# EAGLE design board (EAGLE 6.5.0)
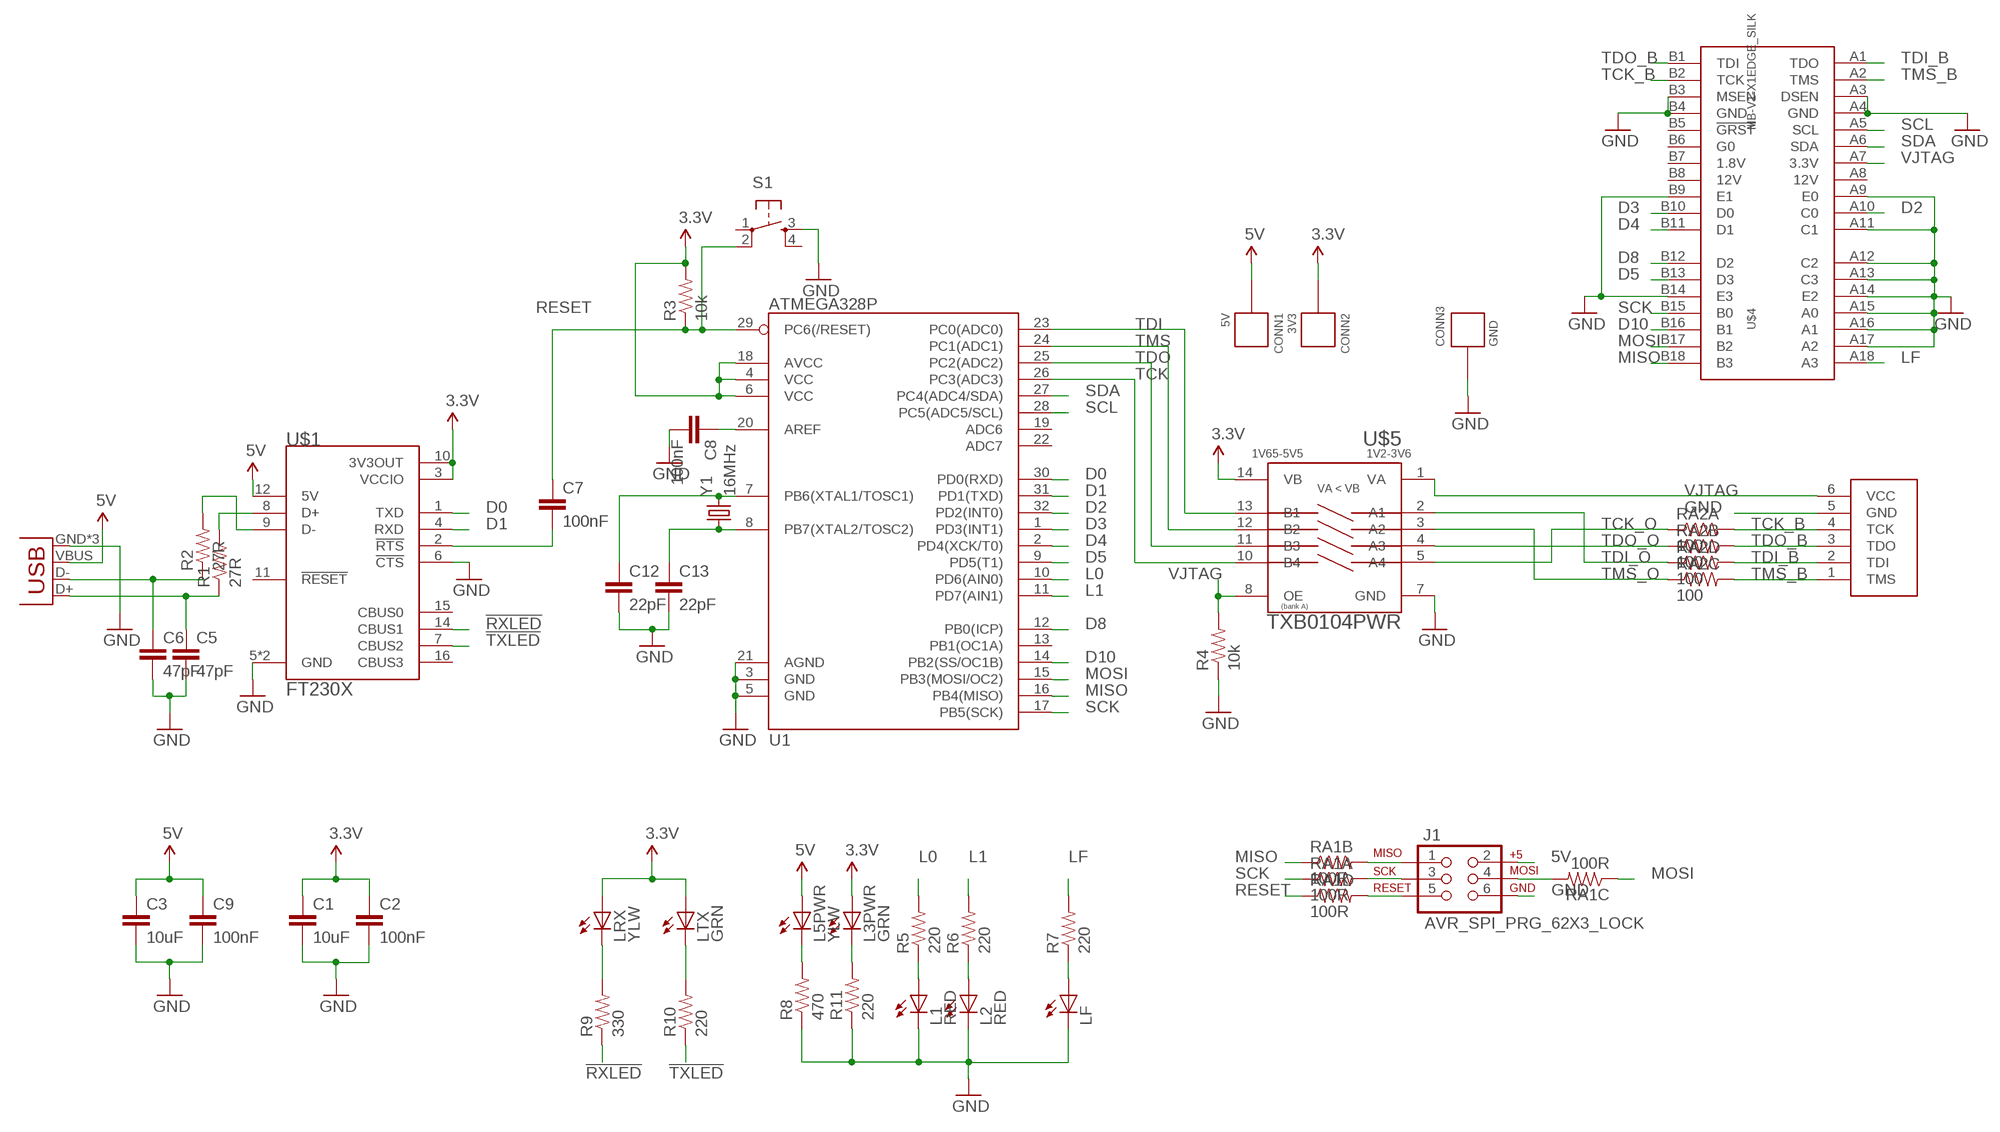
[diagram p0: schematic, sheet 1]

## Parts
C1  10uF  CAP0805  [0805]
C2  100nF  CAP0402-CAP  [0402-CAP]
C3  10uF  CAP0805  [0805]
C5  47pF  CAP0402-CAP  [0402-CAP]
C6  47pF  CAP0402-CAP  [0402-CAP]
C7  100nF  CAP0402-CAP  [0402-CAP]
C8  100nF  CAP0402-CAP  [0402-CAP]
C9  100nF  CAP0402-CAP  [0402-CAP]
C12  22pF  CAP0402-CAP  [0402-CAP]
C13  22pF  CAP0402-CAP  [0402-CAP]
CONN1  5V  CONNECTOR22AWG  [HOLE_22AWG]
CONN2  3V3  CONNECTOR22AWG  [HOLE_22AWG]
CONN3  GND  CONNECTOR22AWG  [HOLE_22AWG]
J1  AVR_SPI_PRG_62X3_LOCK  [2X3_LOCK]
JP1  USB-MICROB  [USB-MICROB]
L1  RED  LED0603  [0603_LED]
L2  RED  LED0603  [0603_LED]
L3PWR  GRN  LED0603  [0603_LED]
L5PWR  YLW  LED0603  [0603_LED]
LF  LED0603  [0603_LED]
LRX  YLW  LED0603  [0603_LED]
LTX  GRN  LED0603  [0603_LED]
R1  27R  RESISTOR0603  [0603-RES]
R2  27R  RESISTOR0603  [0603-RES]
R3  10k  RESISTOR0603  [0603-RES]
R4  10k  RESISTOR0603  [0603-RES]
R5  220  RESISTOR0603  [0603-RES]
R6  220  RESISTOR0603  [0603-RES]
R7  220  RESISTOR0603  [0603-RES]
R8  470  RESISTOR0603  [0603-RES]
R9  330  RESISTOR0603  [0603-RES]
R10  220  RESISTOR0603  [0603-RES]
R11  220  RESISTOR0603  [0603-RES]
RA1  100R  RESISTOR_ARRAY0603_X4  [0603-ARV]
RA2  100  RESISTOR_ARRAY0603_X4  [0603-ARV]
S1  TAC_SWITCHPTH  [TACTILE-PTH]
U1  ATMEGA328P  ATMEGA328_SMT  [TQFP32-08]
U$1  FT230X  [TSSOP16]
U$2  JTAGDIGILENT  [1X06]
U$4  MB-V1-X1EDGE_SILK  [MB-V1-X1-EDGE]
U$5  TXB0104PWR  [TSSOP14]
Y1  16MHz  CRYSTALHC49US  [HC49US]

## Nets
3.3V: C1.1 C2.1 CONN2.P L3PWR.A LRX.A LTX.A R3.2 U1.4(VCC) U1.6(VCC) U1.18(AVCC) U$1.3(VCCIO) U$1.10(3V3OUT) U$5.14(VB)
5V: C3.1 C9.1 CONN1.P J1.2 JP1.VBUS L5PWR.A U$1.12(5V)
!RXLED: R9.1 U$1.14(CBUS1)
!TXLED: R10.1 U$1.7(CBUS2)
D0: U1.30(PD0(RXD)) U$1.1(TXD)
D1: U1.31(PD1(TXD)) U$1.4(RXD)
D2: U1.32(PD2(INT0)) U$4.A10(C0)
D3: U1.1(PD3(INT1)) U$4.B10(D0)
D4: U1.2(PD4(XCK/T0)) U$4.B11(D1)
D5: U1.9(PD5(T1)) U$4.B13(D3)
D8: U1.12(PB0(ICP)) U$4.B12(D2)
D10: U1.14(PB2(SS/OC1B)) U$4.B16(B1)
GND: C1.2 C2.2 C3.2 C5.2 C6.2 C8.2 C9.2 C12.2 C13.2 CONN3.P J1.6 JP1.GND JP1.MT1(GND) JP1.MT2(GND) L1.C L2.C LF.C R4.1 R8.1 R11.1 S1.3 U1.3(GND) U1.5(GND) U1.21(AGND) U$1.5(GND) U$1.6(!CTS) U$1.13(GND) U$2.5(GND) U$4.A3(DSEN) U$4.A4(GND) U$4.A9(E0) U$4.A11(C1) U$4.A12(C2) U$4.A13(C3) U$4.A14(E2) U$4.A15(A0) U$4.A16(A1) U$4.A17(A2) U$4.B3(MSEN) U$4.B4(GND) U$4.B9(E1) U$4.B14(E3) U$5.7(GND)
L0: R5.2 U1.10(PD6(AIN0))
L1: R6.2 U1.11(PD7(AIN1))
LF: R7.2 U$4.A18(A3)
MISO: RA1.2 U1.16(PB4(MISO)) U$4.B18(B3)
MOSI: RA1.3 U1.15(PB3(MOSI/OC2)) U$4.B17(B2)
N$1: R1.2 U$1.8(D+)
N$2: R2.2 U$1.9(D-)
N$3: C6.1 JP1.D- R2.1
N$4: C5.1 JP1.D+ R1.1
N$5: C7.2 U$1.2(!RTS)
N$6: L1.A R5.1
N$7: C12.1 U1.7(PB6(XTAL1/TOSC1)) Y1.2
N$8: C8.1 U1.20(AREF)
N$9: J1.1 RA1.7
N$10: C13.1 U1.8(PB7(XTAL2/TOSC2)) Y1.1
N$11: L5PWR.C R8.2
N$12: L2.A R6.1
N$13: LF.A R7.1
N$15: LRX.C R9.2
N$16: LTX.C R10.2
N$17: J1.4 RA1.6
N$18: L3PWR.C R11.2
N$19: J1.5 RA1.5
N$20: J1.3 RA1.8
RESET: C7.1 R3.1 RA1.4 S1.2 U1.29(PC6(/RESET))
SCK: RA1.1 U1.17(PB5(SCK)) U$4.B15(B0)
SCL: U1.28(PC5(ADC5/SCL)) U$4.A5(SCL)
SDA: U1.27(PC4(ADC4/SDA)) U$4.A6(SDA)
TCK: U1.26(PC3(ADC3)) U$5.10(B4)
TCK_B: RA2.8 U$2.4(TCK) U$4.B2(TCK)
TCK_O: RA2.1 U$5.5(A4)
TDI: U1.23(PC0(ADC0)) U$5.13(B1)
TDI_B: RA2.5 U$2.2(TDI) U$4.A1(TDO)
TDI_O: RA2.4 U$5.2(A1)
TDO: U1.25(PC2(ADC2)) U$5.11(B3)
TDO_B: RA2.7 U$2.3(TDO) U$4.B1(TDI)
TDO_O: RA2.2 U$5.4(A3)
TMS: U1.24(PC1(ADC1)) U$5.12(B2)
TMS_B: RA2.6 U$2.1(TMS) U$4.A2(TMS)
TMS_O: RA2.3 U$5.3(A2)
VJTAG: R4.2 U$2.6(VCC) U$4.A7(3.3V) U$5.1(VA) U$5.8(OE)
Unconnected: S1.1 S1.4 U1.13(PB1(OC1A)) U1.19(ADC6) U1.22(ADC7) U$1.11(!RESET) U$1.15(CBUS0) U$1.16(CBUS3) U$4.A8(12V) U$4.B5(!GRST) U$4.B6(G0) U$4.B7(1.8V) U$4.B8(12V)

## Library data of the parts
C1-C3 C5-C9 C12 C13 = kmod-passives:CAP: Capacitor Standard 0603 ceramic capacitor, and 0.1" leaded capacitor.
CONN1-CONN3 = kmod-nonparts:CONNECTOR: Collection of holes/pads for testing/connecting
J1 = SparkFun-Connectors:AVR_SPI_PRG_6: AVR ISP 6 Pin This is the reduced ISP connector for AVR programming. Common on Arduino. This footprint will take up less PCB space and can be used with a 10-pin to 6-pin adapter such as SKU: BOB-08508
JP1 = SparkFun-Connectors:USB: USB Connectors USB-B-PTH is fully proven SKU : PRT-00139/CONN-08278 USB-miniB is fully proven SKU : PRT-00587 USB-A-PCB is untested. USB-A-H is throughly reviewed, but untested. Spark Fun Electronics SKU : PRT-00437 USB-B-SMT is throughly reviewed, but untested. Needs silkscreen touching up. USB-A-S has not been used/tested USB-MB-H has not been used/tested USB-MICROB has been used. CONN-09505; PROD_ID: CONN-09505
L1 L2 L3PWR L5PWR LF LRX LTX = kmod-passives:LED
R1-R11 = kmod-passives:RESISTOR: Resistor Basic schematic elements and footprints for 0603, 1206, and PTH resistors.
RA1 RA2 = kmod-passives:RESISTOR_ARRAY
S1 = kmod-mechanical:TAC_SWITCH: Momentary Switch Button commonly used for reset or general input. Spark Fun Electronics SKU : COM-00097 SMT- SWCH-08247
U1 = SparkFun-DigitalIC:ATMEGA328_SMT: 32-Pin Atmega328 part Commonly used on Arduino compatible boards Available in QFP and QFN packages TQFP is IC-09069 QFN is non-stock; PROD_ID: IC-09069
U$1 = kmod-testing:FT230X
U$2 = kmod-connectors:JTAG: JTAG connector, as on the Digilent Nexys3
U$4 = kmod-connectors:MB-V1-X1
U$5 = kmod-testing:TXB0104: TI 4-bit bidirectional voltage translator
Y1 = SparkFun-FreqCtrl:CRYSTAL: Various standard crystals. Proven footprints. Spark Fun Electronics SKU : COM-00534

## Board
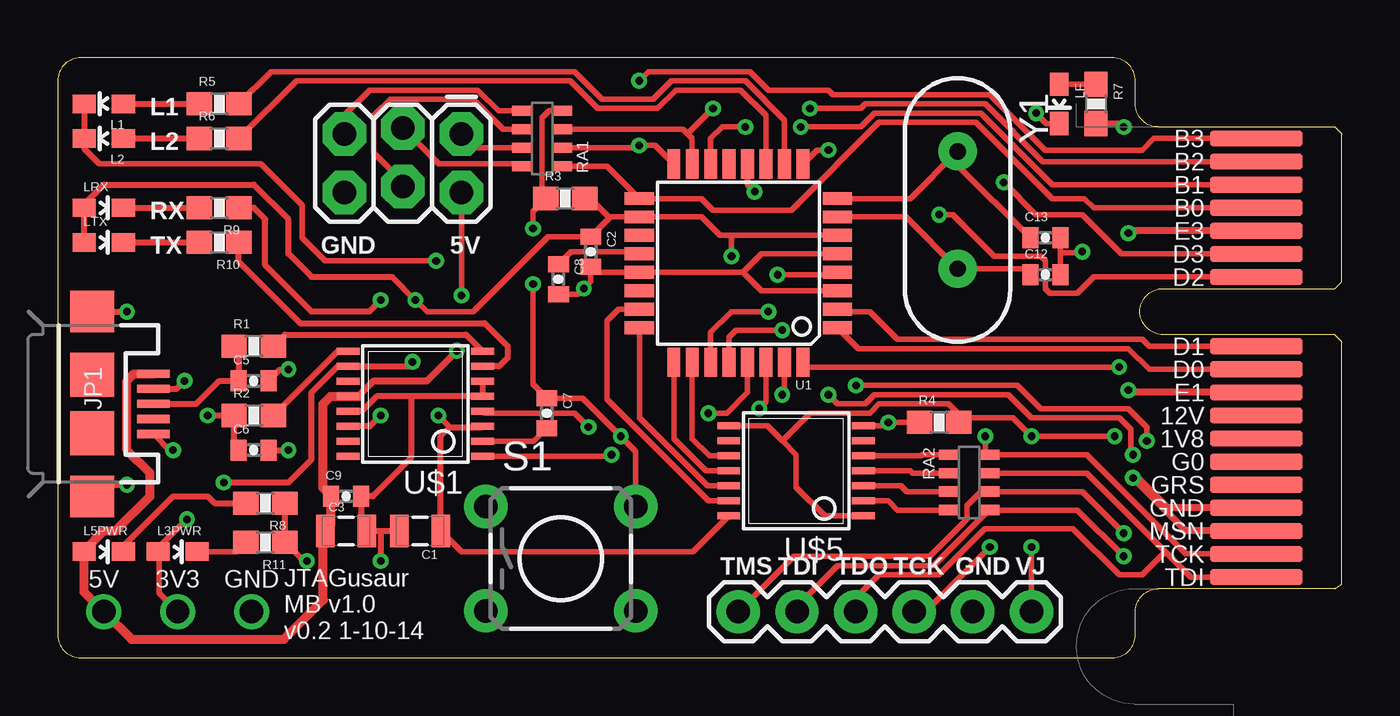
[diagram p1: board, top side]
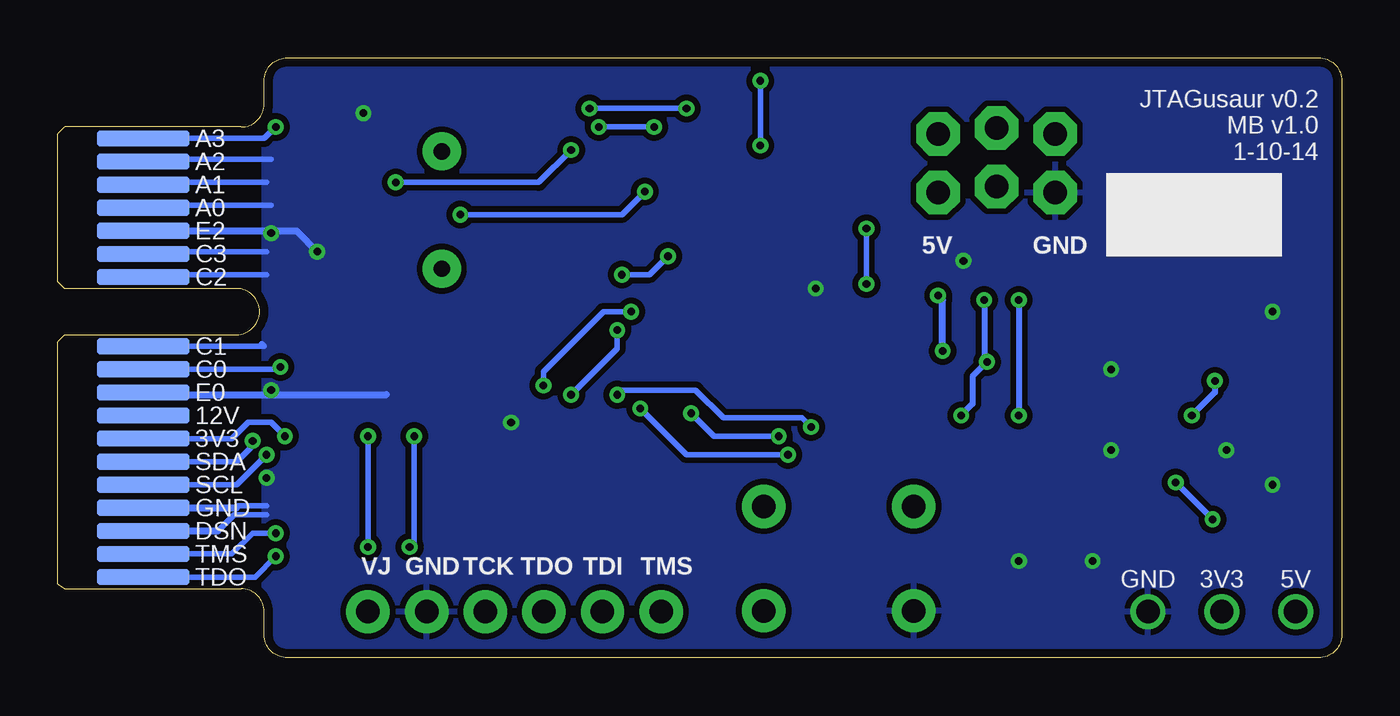
[diagram p2: board, bottom side, seen from below]

Size 55.65 x 26 mm. Coordinates in mm from the lower left corner, seen from the top.
Outline: 47.7,3 arc90 46.7,2 46.7,1 arc-90 45.7,0 1,0 arc-90 0,1 0,25 arc-90 1,26 45.7,26 arc-90 46.7,25 46.7,24 arc90 47.7,23
Copper layers (1*16): Top 0.0356mm / dielectric 1.5011mm / Bottom 0.0356mm
Design rules "OSHPark_mine *": minimum track width 6mil, minimum drill 13mil, track to track 6mil, track to pad 6mil, pad to pad 6mil, via to via 6mil, smd to smd 6mil, copper to edge 15mil, drill to drill 6mil, minimum pad ring 7mil, minimum via ring 7mil, stop-mask expansion 2mil, vias tented up to drill 13mil, thermal gap 10mil

### Footprints (pad centres in the part's own frame; a part is rotated, then mirrored left to right if it is on the bottom)
0805 = smd 0.8 x 1.4: 1 -0.9,0; 2 0.9,0
0402-CAP = smd 0.7 x 0.9: 1 -0.65,0; 2 0.65,0
HOLE_22AWG = drill 1.016: P 0,0
2X3_LOCK = drill 1.016 pad 1.88 octagon: 1 0,0; 2 0,2.54; 3 2.54,-0.254; 4 2.54,2.286; 5 5.08,0; 6 5.08,2.54
USB-MICROB = smd 0.35 x 1.4: D+ 0,2.65; D- -0.65,2.65; GND 1.3,2.65; ID 0.65,2.65; VBUS -1.3,2.65 | smd 1.8 x 1.9: MT1 -4,0; MT2 4,0 | smd 1.9 x 1.9: P$1 -1.27,0; P$2 1.27,0
0603_LED = smd 0.8 x 1.003: A 0,-0.852; C 0,0.852
0603-RES = smd 1.1 x 1: 1 -0.85,0; 2 0.85,0
0603-ARV = smd 0.45 x 0.9: 1 -1.2,-0.85; 2 -0.4,-0.85; 3 0.4,-0.85; 4 1.2,-0.85; 5 1.2,0.85; 6 0.4,0.85; 7 -0.4,0.85; 8 -1.2,0.85
TACTILE-PTH = drill 1.016 pad 1.88: 1 -3.251,2.261; 2 3.251,2.261; 3 -3.251,-2.261; 4 3.251,-2.261
TQFP32-08 = smd 1.27 x 0.559: 1 -4.293,2.8; 2 -4.293,2; 3 -4.293,1.2; 4 -4.293,0.4; 5 -4.293,-0.4; 6 -4.293,-1.2; 7 -4.293,-2; 8 -4.293,-2.8; 17 4.293,-2.8; 18 4.293,-2; 19 4.293,-1.2; 20 4.293,-0.4; 21 4.293,0.4; 22 4.293,1.2; 23 4.293,2; 24 4.293,2.8 | smd 0.559 x 1.27: 9 -2.8,-4.293; 10 -2,-4.293; 11 -1.2,-4.293; 12 -0.4,-4.293; 13 0.4,-4.293; 14 1.2,-4.293; 15 2,-4.293; 16 2.8,-4.293; 25 2.8,4.293; 26 2,4.293; 27 1.2,4.293; 28 0.4,4.293; 29 -0.4,4.293; 30 -1.2,4.293; 31 -2,4.293; 32 -2.8,4.293
TSSOP16 = smd 0.305 x 0.991: 1 -2.275,-2.918; 2 -1.625,-2.918; 3 -0.975,-2.918; 4 -0.325,-2.918; 5 0.325,-2.918; 6 0.975,-2.918; 7 1.625,-2.918; 8 2.275,-2.918; 9 2.275,2.918; 10 1.625,2.918; 11 0.975,2.918; 12 0.325,2.918; 13 -0.325,2.918; 14 -0.975,2.918; 15 -1.625,2.918; 16 -2.275,2.918
1X06 = drill 1.016 pad 1.88: 1 0,0; 2 2.54,0; 3 5.08,0; 4 7.62,0; 5 10.16,0; 6 12.7,0
MB-V1-X1-EDGE = smd 0.7 x 4 bottom: A1 -11.5,-0.75; A2 -10.5,-0.75; A3 -9.5,-0.75; A4 -8.5,-0.75; A5 -7.5,-0.75; A6 -6.5,-0.75; A7 -5.5,-0.75; A8 -4.5,-0.75; A9 -3.5,-0.75; A10 -2.5,-0.75; A11 -1.5,-0.75; A12 1.5,-0.75; A13 2.5,-0.75; A14 3.5,-0.75; A15 4.5,-0.75; A16 5.5,-0.75; A17 6.5,-0.75; A18 7.5,-0.75 | smd 0.7 x 4: B1 -11.5,-0.75; B2 -10.5,-0.75; B3 -9.5,-0.75; B4 -8.5,-0.75; B5 -7.5,-0.75; B6 -6.5,-0.75; B7 -5.5,-0.75; B8 -4.5,-0.75; B9 -3.5,-0.75; B10 -2.5,-0.75; B11 -1.5,-0.75; B12 1.5,-0.75; B13 2.5,-0.75; B14 3.5,-0.75; B15 4.5,-0.75; B16 5.5,-0.75; B17 6.5,-0.75; B18 7.5,-0.75
TSSOP14 = smd 0.305 x 0.991: 1 -1.95,-2.918; 2 -1.3,-2.918; 3 -0.65,-2.918; 4 0,-2.918; 5 0.65,-2.918; 6 1.3,-2.918; 7 1.95,-2.918; 8 1.95,2.918; 9 1.3,2.918; 10 0.65,2.918; 11 0,2.918; 12 -0.65,2.918; 13 -1.3,2.918; 14 -1.95,2.918
HC49US = drill 0.7 pad 1.651: 1 -2.54,0; 2 2.54,0

### Placement (x,y rotation side)
C1  15.7,5.5 180 top
C2  23.1,17.6 270 top
C3  12.5,5.5 0 top
C5  8.5,12 0 top
C6  8.5,9 0 top
C7  21.2,10.6 270 top
C8  21.7,16.4 270 top
C9  12.5,7 0 top
C12  42.8,16.6 0 top
C13  42.8,18.2 0 top
CONN1  2,2 180 top
CONN2  5.2,2 180 top
CONN3  8.4,2 180 top
J1  17.5,22.7 180 top
JP1  1.5,11 270 top
L1  2,24 90 top
L2  2,22.5 90 top
L3PWR  5.2,4.6 270 top
L5PWR  2,4.6 270 top
LF  43.4,24 180 top
LRX  2,19.5 270 top
LTX  2,18 270 top
R1  8.5,13.5 0 top
R2  8.5,10.5 0 top
R3  22,19.9 0 top
R4  38.2,10.2 0 top
R5  7,24 0 top
R6  7,22.5 0 top
R7  45,24 270 top
R8  9,6.7 180 top
R9  7,19.5 180 top
R10  7,18 180 top
R11  9,5 180 top
RA1  21,22.5 90 top
RA2  39.5,7.6 270 top
S1  21.8,4.3 0 top
U1  29.5,17.1 180 top
U$1  15.5,11 90 top
U$2  29.5,2 0 top
U$4  51.2,15 90 top
U$5  32,8.1 90 top
Y1  39,19.4 270 top

### Tracks (layer width: path | path; a pad name or v marks a point on that pad's centre or on a via)
3.3V  (via drill 0.33)
  Top 0.229: 23.93,19.07 C2.1 21.25,18.25 18,15 16,15 v15.5,15.5 | 23.93,19.07 23.95,19.1 U1.18 27.9,19.1 28.7,18.3 29.2,18.3 | 29.2,18.3 U1.6 | U1.4 33.69,16.6 v31.2,16.6 | v29.2,17.4 29.2,18.3 | R3.2 23.1,19.9 23.93,19.07 | U$5.14 27.53,4.6 17.5,4.6 C1.1 | CONN2.P 4.4,2.8 4.4,4.55 L3PWR.A 4.35,4.85 4.45,4.85 v5.6,6
  Top 0.254: LTX.A LRX.A 1.15,19.65 2,20.5 8.5,20.5 10,19 10,17.5 11,16.5 14.5,16.5 v15.5,15.5 | v7.2,7.6 10,7.6 11,8.6 11,11.5 12.12,12.62 U$1.10 15.18,12.62 v15.38,12.82 | C1.1 16.6,9.6 17,10 | 17,10 18.39,10 U$1.3 | v16.5,10.5 17,10
  Bottom 0.229: v31.2,16.6 30,16.6 v29.2,17.4
  Bottom 0.254: v5.6,6 v7.2,7.6 | v16.5,10.5 16,11 16,12.2 v15.38,12.82 15.5,12.95 v15.5,15.5
5V  (via drill 0.33)
  Top 0.229: v17.5,15.7 J1.2
  Top 0.254: L5PWR.A 1.15,4.65
  Top 0.305: 13.03,11.32 13.7,12 16,12 v17.3,13.3
  Top 0.381: L5PWR.A 1.15,2.85 CONN1.P 3.2,0.8 9.8,0.8 11.51,2.51 11.51,5.41 C3.1 11.85,5.75 C9.1 11.5,7.35 11.5,11 11.82,11.32 U$1.12 13.03,11.32 | 1.15,4.65 2,5.5 2.5,5.5 4,7 4,8 3,9 3,12 3.3,12.3 JP1.VBUS
  Bottom 0.305: v17.3,13.3 17.3,15.5 v17.5,15.7
!RXLED  (via drill 0.33)
  Top 0.254: R9.1 8.5,19.5 9,19 9,17 11,15 13.5,15 v14,15.5 | v14,10.5 13.53,10.03 U$1.14
  Bottom 0.254: v14,15.5 v14,10.5
!TXLED
  Top 0.254: U$1.7 19.12,12.62 19.5,13 19.5,13.5 18.5,14.5 10.5,14.5 7.85,17.15 R10.1
D0  (via drill 0.33)
  Top 0.229: U$1.1 23.93,8.72 v24,8.8 | v30.4,10.8 30.7,11.1 U1.30
  Bottom 0.229: v24,8.8 28.4,8.8 v30.4,10.8
D1  (via drill 0.33)
  Top 0.229: U$1.4 18.49,10.6 22.4,10.6 v23,10 | v31.4,11.4 31.5,11.5 U1.31
  Bottom 0.229: v23,10 23.4,10.4 26.8,10.4 28,11.6 31.2,11.6 v31.4,11.4
D2  (via drill 0.33)
  Top 0.229: v46,12.6 32.51,12.6 U1.32
  Bottom 0.229: U$4.A10 46.1,12.5 v46,12.6
D3
  Top 0.229: U$4.B10 47.3,12.5 46.4,13.4 34.69,13.4 U1.1
D4
  Top 0.229: U$4.B11 47.3,13.5 47,13.8 37.8,13.8 37.6,13.8 36.4,13.8 35.2,15 33.89,15 U1.2
D5  (via drill 0.33)
  Top 0.229: U1.9 32.91,22 v33.4,22 | v41,20.6 42.4,19.2 44.4,19.2 46.1,17.5 U$4.B13
  Bottom 0.229: v33.4,22 34.8,20.6 v41,20.6
D8  (via drill 0.33)
  Top 0.229: U1.12 29.9,20.5 v30.2,20.2 | v38.2,19.2 38.8,19.2 40.6,17.4 42.6,17.4 42.8,17.2 42.8,16 43,15.8 44.2,15.8 44.9,16.5 U$4.B12
  Bottom 0.229: v30.2,20.2 31.2,19.2 v38.2,19.2
D10  (via drill 0.33)
  Top 0.229: U$4.B16 43.1,20.5 40,23.6 35.4,23.6 34.8,23 v32.2,23 | v29.8,23 28.8,23 28.3,22.5 U1.14
  Bottom 0.229: v32.2,23 v29.8,23
GND  (via drill 0.33)
  Top 0.229: LF.C 42.85,23.15 v42.4,23.6 | U1.5 30.5,17.5 29.7,16.7 | 29.7,16.7 U1.21 23.35,16.7 C2.2 23.1,16.3 v22.8,16 22.55,15.75 C8.2 | U1.3 30.5,15.9 29.7,16.7 | C13.2 43.45,17.54 | 43.45,17.54 C12.2 | 43.45,17.54 44.34,17.54 v44.4,17.6 | U$5.7 35.85,10.05 v36,10.2 R4.1 | L2.C 1.15,22.05 1.8,21.4 8.8,21.4 10.6,19.6 10.6,18.2 11.6,17.2 v16.4,17.2 | R11.1 10.65,4.2 v10.8,4.2
  Top 0.254: JP1.MT2 2,7.5 v3,7.5 | JP1.GND 4.85,9 v5,9 | JP1.MT1 v3,15 | C5.2 9.65,12.5 v10,12.5 | C6.2 v10,9 | R11.1 R8.1 | U$1.6 U$1.5 15.31,11.32 | 15.31,11.32 13.82,11.32 13.18,10.68 U$1.13 | 15.31,11.32 15.31,8.66 13.65,7 C9.2 13.15,5.75 C3.2 14,5.5 | 14,5.5 C1.2 | 14,5.5 v14,4.2 | L1.C L2.C
  Top 0.305: U$4.A3 48.9,5.5 v46.6,7.8 46.8,7.8 48.1,6.5 U$4.A4 | U$4.B14 46.5,18.5 v46.4,18.4 | U$4.B9 46.5,11.5 v46.4,11.6
  Bottom 0.229: U$4.A12 51.85,16.6 46.6,16.6 | U$4.A13 51.85,17.6 46.6,17.6 | U$4.A15 51.85,19.6 46.4,19.6 | U$4.A16 51.85,20.6 46.6,20.6 | U$4.A17 51.85,21.6 46.4,21.6 | U$4.A11 46.7,13.5 46.8,13.6 | 48.7,5.5 48,6.2 46.6,6.2 | 47.9,6.5 47.8,6.6 46.6,6.6
  Bottom 0.305: U$4.A4 47.9,6.5 | U$4.A3 48.7,5.5 | U$4.B9 51.85,11.4 41.4,11.4 | U$4.B14 45.3,18.5 v44.4,17.6
  pour Bottom (isolate 0.254): 46.7,0 0,0 0,26 46.7,26
L0
  Top 0.229: R5.2 9.25,25.4 22.4,25.4 23.6,24.2 25.8,24.2 26.6,25 29.8,25 31.5,23.3 U1.10
L1
  Top 0.229: R6.2 10.35,25 22.2,25 23.4,23.8 26,23.8 26.8,24.6 29.6,24.6 30.7,23.5 U1.11
LF  (via drill 0.33)
  Top 0.229: v46.2,23 46.05,23.15 R7.2
  Bottom 0.229: U$4.A18 46.7,22.5 v46.2,23
MISO  (via drill 0.33)
  Top 0.229: U1.16 25.89,22.2 v25.2,22.2 25.1,22.1 RA1.2 | U$4.B18 47.5,22.5 47,22 42.8,22 40.4,24.4 33.6,24.4 33.4,24.6 30.8,24.6 30,25.4 25.6,25.4 v25.2,25
  Bottom 0.229: v25.2,25 v25.2,22.2
MOSI  (via drill 0.33)
  Top 0.229: RA1.3 27.1,22.9 27.3,22.7 | 27.3,22.7 27.5,22.5 U1.15 | U$4.B17 42.7,21.5 40.2,24 35,24 34.8,23.8 v32.6,23.8 | v28.4,23.8 27.3,22.7
  Bottom 0.229: v32.6,23.8 v28.4,23.8
N$1
  Top 0.254: R1.2 9.85,14 17.69,14 U$1.8
N$2
  Top 0.254: R2.2 12.12,13.28 U$1.9
N$3  (via drill 0.33)
  Top 0.254: C6.1 7.65,9.2 R2.1 v6.5,10.5 | JP1.D- 5.15,11.65 v5.5,12
  Bottom 0.254: v5.5,12 5.5,11.5 v6.5,10.5
N$4
  Top 0.254: R1.1 7.85,13.3 C5.1 7,12 6,11 JP1.D+
N$5
  Top 0.229: U$1.2 20.62,9.38 C7.2
N$6
  Top 0.254: L1.A R5.1
N$7
  Top 0.229: U1.7 36.76,19.1 Y1.2 41.89,16.86 C12.1
N$8
  Top 0.229: U1.20 25.11,17.6 22.25,17.6 C8.1
N$9
  Top 0.229: RA1.7 18.1,22.1 J1.1
N$10
  Top 0.229: U1.8 36.96,19.9 Y1.1 39,21.35 C13.1
N$11
  Top 0.254: L5PWR.C 2.85,4.85 5,7 6.5,7 6.8,6.7 R8.2
N$12
  Top 0.254: L2.A R6.1
N$13
  Top 0.229: LF.A R7.1
N$15
  Top 0.254: LRX.C R9.2
N$16
  Top 0.254: LTX.C R10.2
N$17
  Top 0.229: RA1.6 19.3,22.9 18,24.2 14.4,24.2 13.7,23.5 13.7,21.87 14.96,20.61 J1.4
N$18
  Top 0.229: L3PWR.C 7.75,4.6 R11.2
N$19
  Top 0.229: RA1.5 19.1,23.7 18.2,24.6 13.52,24.6 12.42,23.5 J1.5
N$20
  Top 0.229: RA1.8 20.05,21.4 16.51,21.4 J1.3
RESET  (via drill 0.33)
  Top 0.229: RA1.4 21.3,23.7 21,23.4 21,20.05 R3.1 20.6,19.35 v20.6,18.6 | S1.2 25.05,8.95 v24.4,9.6 22.75,11.25 C7.1 20.6,11.85 v20.6,16.2 | v28.2,10.6 29,10.6 29.9,11.5 U1.29
  Bottom 0.229: v20.6,16.2 v20.6,18.6 | v24.4,9.6 27.2,9.6 v28.2,10.6
SCK
  Top 0.229: RA1.1 23.81,21.3 U1.17 27.9,19.9 28.4,19.4 31.8,19.4 35.6,23.2 39.8,23.2 43.1,19.9 44.5,19.9 44.9,19.5 U$4.B15
SCL  (via drill 0.33)
  Top 0.229: U1.28 29.1,13.9 29.4,14.2 v31.4,14.2 | v33.4,11.4 33.8,11 35,11 35.4,11.4 41.2,11.4 42.2,10.4 46,10.4 46.5,9.9 46.5,8.9 v46.6,8.8
  Bottom 0.229: v31.4,14.2 31.4,13.4 v33.4,11.4 | v46.6,8.8 47.9,7.5 U$4.A5
SDA  (via drill 0.33)
  Top 0.229: U1.27 28.3,14.1 29.2,15 v30.8,15 | v34.6,11.8 41.6,11.8 42.6,10.8 46.4,10.8 47.2,10 v47.2,9.4
  Bottom 0.229: v30.8,15 32,15 34.6,12.4 v34.6,11.8 | v47.2,9.4 47.2,9.2 47.9,8.5 U$4.A6
TCK
  Top 0.229: U$5.10 28.25,8.75 27.5,9.5 U1.26
TCK_B  (via drill 0.33)
  Top 0.229: U$4.B2 48.9,4.5 44.6,8.8 RA2.8 40.2,8.95 v40.2,9.6 | v40.4,4.8 37.6,2 U$2.4
  Bottom 0.229: v40.4,4.8 40.2,5 v40.2,9.6
TCK_O
  Top 0.229: U$5.5 37.4,8.75 37.45,8.8 RA2.1
TDI
  Top 0.229: U$5.13 28.2,6.8 23.8,11.2 23.8,14.6 24.3,15.1 U1.23
TDI_B  (via drill 0.33)
  Top 0.229: v46.2,4.4 44.2,6.4 RA2.5 37.95,4 33.8,4 32.04,2.24 U$2.2
  Bottom 0.229: U$4.A1 47.1,3.5 v46.2,4.4
TDI_O
  Top 0.229: U$5.2 36,6.8 36.4,6.4 RA2.4
TDO
  Top 0.229: U$5.11 28.1,8.1 26.7,9.5 U1.25
TDO_B
  Top 0.229: U$4.B1 49.1,3.5 48,4.6 | 48,4.6 44.6,8 RA2.7 | 48,4.6 47,3.6 46,3.6 44,5.6 40.18,5.6 38.18,3.6 35.6,3.6 34.58,2.58 U$2.3
TDO_O
  Top 0.229: U$5.4 36.95,8.1 37.05,8 RA2.2
TMS
  Top 0.229: U$5.12 28.15,7.45 25.21,10.39 U1.24
TMS_B  (via drill 0.33)
  Top 0.229: v46.2,5.4 44.4,7.2 RA2.6 40,7.2 39.4,6.6 39.4,6 37.8,4.4 31.9,4.4 U$2.1
  Bottom 0.229: U$4.A2 48.1,4.5 47.2,5.4 v46.2,5.4
TMS_O
  Top 0.229: U$5.3 36.55,7.45 36.8,7.2 RA2.3
VJTAG  (via drill 0.33)
  Top 0.229: U$5.8 30.75,10.05 31.4,9.4 | 31.4,9.4 32,8.8 32,7.4 33.25,6.15 U$5.1 | 31.4,9.4 32.6,10.6 35.2,10.6 35.6,11 38.6,11 39.2,10.4 | U$2.6 v42.2,4.8 | v45.8,9.6 v42.2,9.6 41.4,10.4 39.2,10.4 | 39.2,10.4 39.2,10.35 R4.2
  Bottom 0.229: v42.2,4.8 v42.2,9.6 | U$4.A7 48.1,9.5 47.4,10.2 46.4,10.2 v45.8,9.6

### Text on the board
tPlace: L1 | L2 | RX | TX | GND | 5V | TMS | TDI | TDO | TCK | GND | VJ | JTAGusaur / MB v1.0 / v0.2 1-10-14
bPlace: JTAGusaur v0.2 / MB v1.0 / 1-10-14 | GND | 5V | TMS | TDI | TDO | TCK | GND | VJ